# EAGLE design qfn-10-socket-pcb-mk-2.0.0-eagle-7.x (EAGLE 7.7.0)
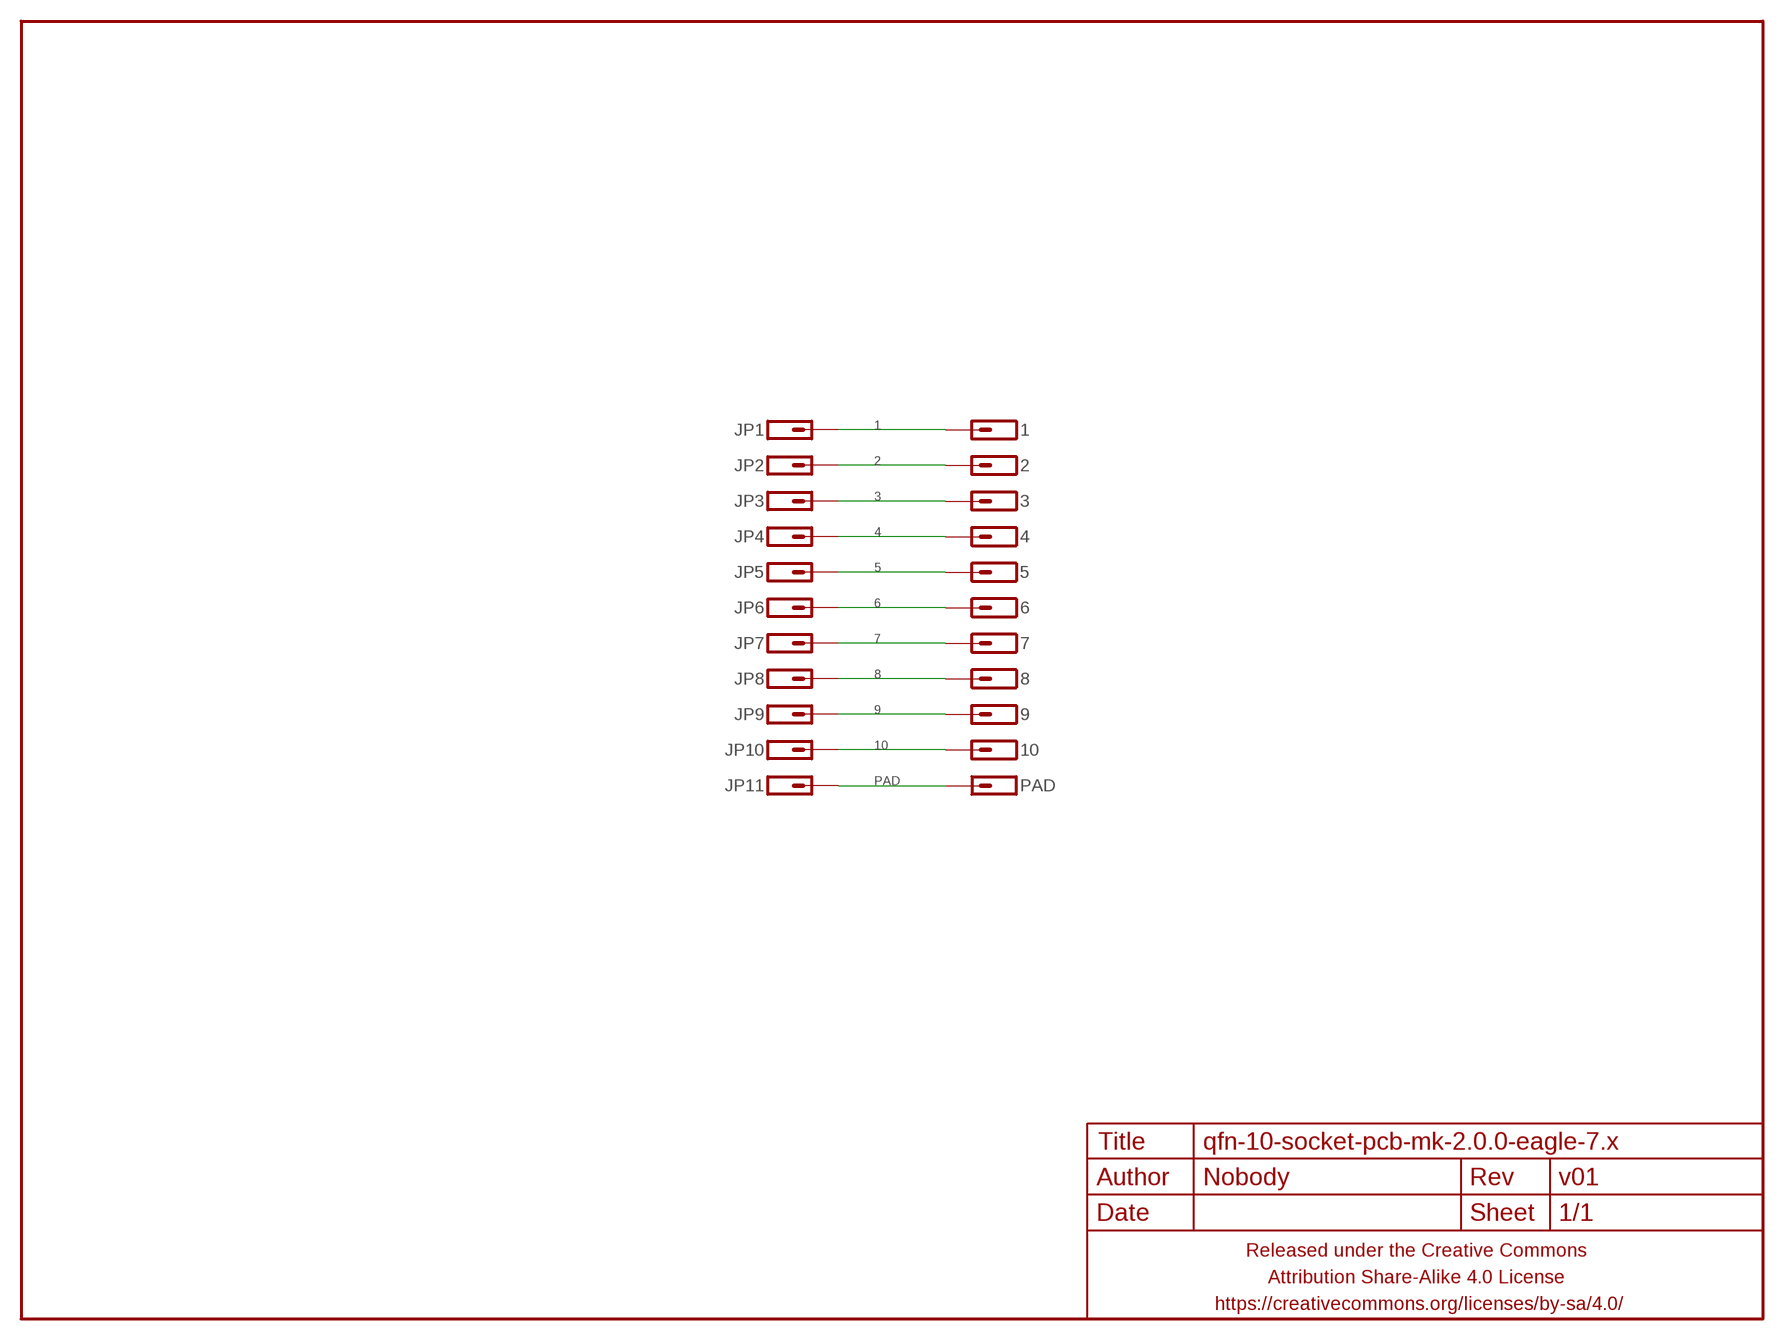
[diagram p0: schematic, sheet 1]

## Parts
1  M01PTH  [1X01]
2  M01PTH  [1X01]
3  M01PTH  [1X01]
4  M01PTH  [1X01]
5  M01PTH  [1X01]
6  M01PTH  [1X01]
7  M01PTH  [1X01]
8  M01PTH  [1X01]
9  M01PTH  [1X01]
10  M01PTH  [1X01]
FRAME1  FRAME-LETTERNO_PACKAGE  [DUMMY]
JP1  M01PTH-0.4MM  [1X01-0.4MM]
JP2  M01PTH-0.4MM  [1X01-0.4MM]
JP3  M01PTH-0.4MM  [1X01-0.4MM]
JP4  M01PTH-0.4MM  [1X01-0.4MM]
JP5  M01PTH-0.4MM  [1X01-0.4MM]
JP6  M01PTH-0.4MM  [1X01-0.4MM]
JP7  M01PTH-0.4MM  [1X01-0.4MM]
JP8  M01PTH-0.4MM  [1X01-0.4MM]
JP9  M01PTH-0.4MM  [1X01-0.4MM]
JP10  M01PTH-0.4MM  [1X01-0.4MM]
JP11  M01PTH  [1X01]
PAD  M01PTH-1MM-CIR-NS  [1X01-1MM-CIR-NS]

## Nets
1: 1.1 JP1.P$1
2: 2.1 JP2.P$1
3: 3.1 JP3.P$1
4: 4.1 JP4.P$1
5: 5.1 JP5.P$1
6: 6.1 JP6.P$1
7: 7.1 JP7.P$1
8: 8.1 JP8.P$1
9: 9.1 JP9.P$1
10: 10.1 JP10.P$1
PAD: JP11.1 PAD.1

## Library data of the parts
1-10 JP1-JP11 PAD = a_parts:M01: Header 1 Standard 1-pin 0.1" header. Use with straight break away headers (SKU : PRT-00116), right angle break away headers (PRT-00553), swiss pins (PRT-00743), machine pins (PRT-00117), and female headers (PRT-00115).
FRAME1 = a_parts:FRAME-LETTER: Schematic Frame Standard 8.5x11 US Letter frame; DESIGNER: Nobody; VERSION: v01

## Board
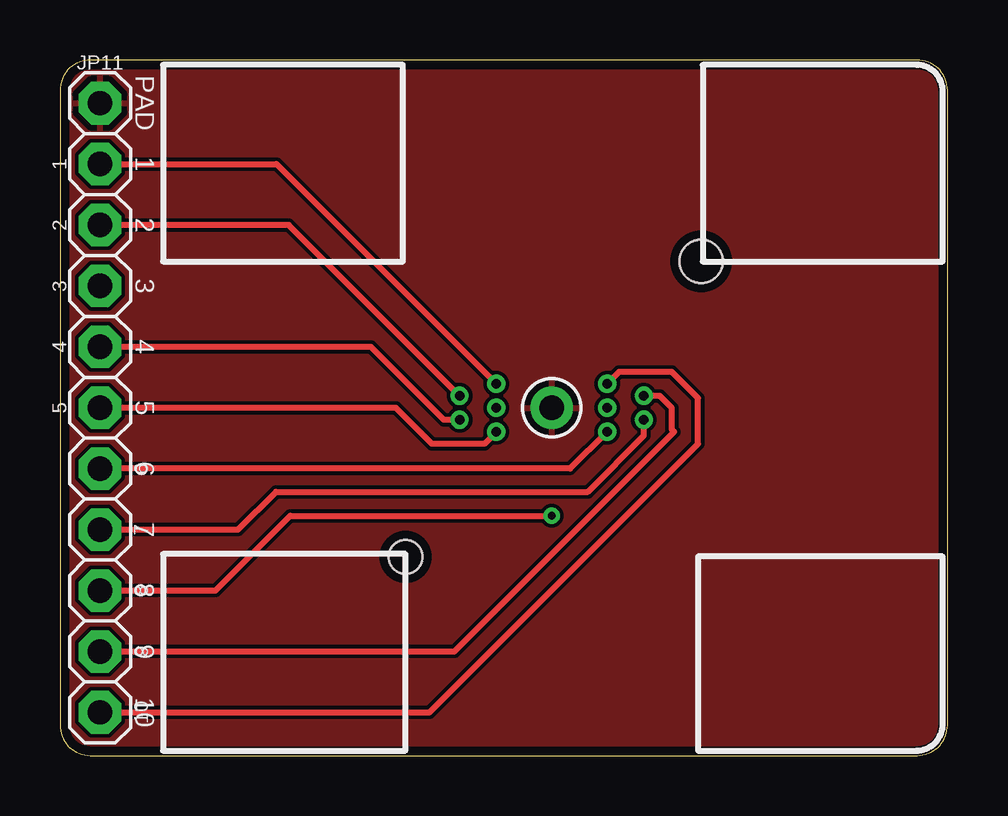
[diagram p1: board, top side]
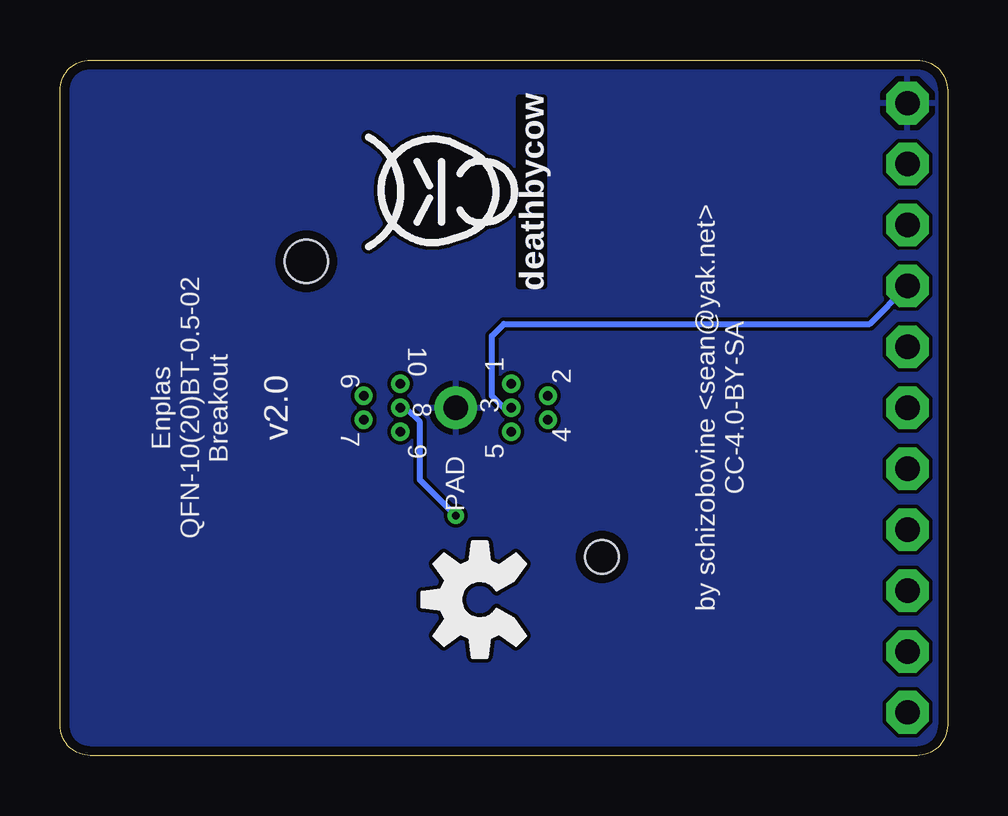
[diagram p2: board, bottom side, seen from below]

Size 37 x 29 mm. Coordinates in mm from the lower left corner, seen from the top.
Outline: 0,27.73 0,1.27 arc90 1.27,0 35.73,0 arc90 37,1.27 37,27.73 arc90 35.73,29 1.27,29 arc90 0,27.73
Copper layers (1*16): Top 0.0356mm / dielectric 1.5011mm / Bottom 0.0356mm
Design rules "LaenPCBOrder_2": minimum track width 6mil, minimum drill 13mil, track to track 6mil, track to pad 6mil, pad to pad 6mil, via to via 6mil, smd to smd 6mil, copper to edge 15mil, drill to drill 6mil, minimum pad ring 7mil, minimum via ring 7mil, stop-mask expansion 3mil, vias tented up to drill 20mil, thermal gap 10mil
Holes 1.8 mm at 26.73,20.6
Holes 1.4 mm at 14.4,8.28
vRestrict: area 4,20.6 to 14.3,29; area 26.7,20.6 to 37,29; area 4,0 to 14.4,8.4; area 26.6,0 to 37,8.4

### Footprints (pad centres in the part's own frame; a part is rotated, then mirrored left to right if it is on the bottom)
1X01 = drill 1.016 pad 1.778 octagon: 1 0,0
1X01-0.4MM = drill 0.4: P$1 0,0
1X01-1MM-CIR-NS = drill 1.016 pad 1.778: 1 0,0

### Placement (x,y rotation side)
1  1.67,24.66 90 top
2  1.67,22.12 90 top
3  1.67,19.58 90 top
4  1.67,17.04 90 top
5  1.67,14.5 90 top
6  1.67,11.96 270 top
7  1.67,9.42 270 top
8  1.67,6.88 270 top
9  1.67,4.34 270 top
10  1.67,1.8 270 top
FRAME1  0,0 0 top
JP1  18.19,15.5 0 top
JP2  16.66,15 0 bottom
JP3  18.19,14.5 0 top
JP4  16.66,14 0 top
JP5  18.19,13.5 0 top
JP6  22.81,13.5 0 top
JP7  24.34,14 0 top
JP8  22.81,14.5 0 top
JP9  24.34,15 0 top
JP10  22.81,15.5 0 top
JP11  1.67,27.2 0 top
PAD  20.5,14.5 0 top
U$1  [COW_SMALL_METAL]  21.6,23.5 90 bottom
U$2  [OSHWLOGO_5MM_METAL]  19.5,6.5 90 bottom

### Tracks (layer width: path | path; a pad name or v marks a point on that pad's centre or on a via)
1
  Top 0.25: 1.1 9.03,24.66 JP1.P$1
2
  Top 0.25: JP2.P$1 9.54,22.12 2.1
3
  Bottom 0.25: JP3.P$1 18.5,14.5 19,15 19,17.5 18.5,18 3.25,18 3.1
4
  Top 0.25: JP4.P$1 16,14 12.96,17.04 4.1
5
  Top 0.25: JP5.P$1 17.69,13 15.5,13 14,14.5 5.1
6
  Top 0.25: JP6.P$1 21.27,11.96 6.1
7
  Top 0.25: 7.1 7.42,9.42 9,11 22,11 24.34,13.34 JP7.P$1
8  (via drill 0.33)
  Top 0.25: 8.1 6.48,6.88 9.6,10 v20.5,10
  Bottom 0.25: v20.5,10 22,11.5 22,13.9 22.6,14.5 JP8.P$1
9
  Top 0.25: 9.1 16.44,4.34 25.6,13.5 25.5,13.6 25.5,14.5 25,15 JP9.P$1
10
  Top 0.25: 10.1 15.4,1.8 26.6,13 26.6,14.9 25.5,16 23.31,16 JP10.P$1
PAD
  pour Top: 0,0 37,0 37,29 0,29
  pour Bottom: 0,0 37,0 37,29 0,29

### Text on the board
bPlace: by schizobovine <sean@yak.net> / CC-4.0-BY-SA | Enplas / QFN-10(20)BT-0.5-02 / Breakout
tNames: PAD | 1 | 2 | 3 | 4 | 5 | 6 | 7 | 8 | 9 | 10
bNames: 2 | 1 | 10 | 3 | 6 | 4 | 8 | 7 | 5 | 9 | PAD